# Altium schematic sheet Fighter_old.SchDoc
size 292 x 193 mm; Author: Power Lin; SheetNumber: 1; SheetTotal: 1; Website: wiki-power.com
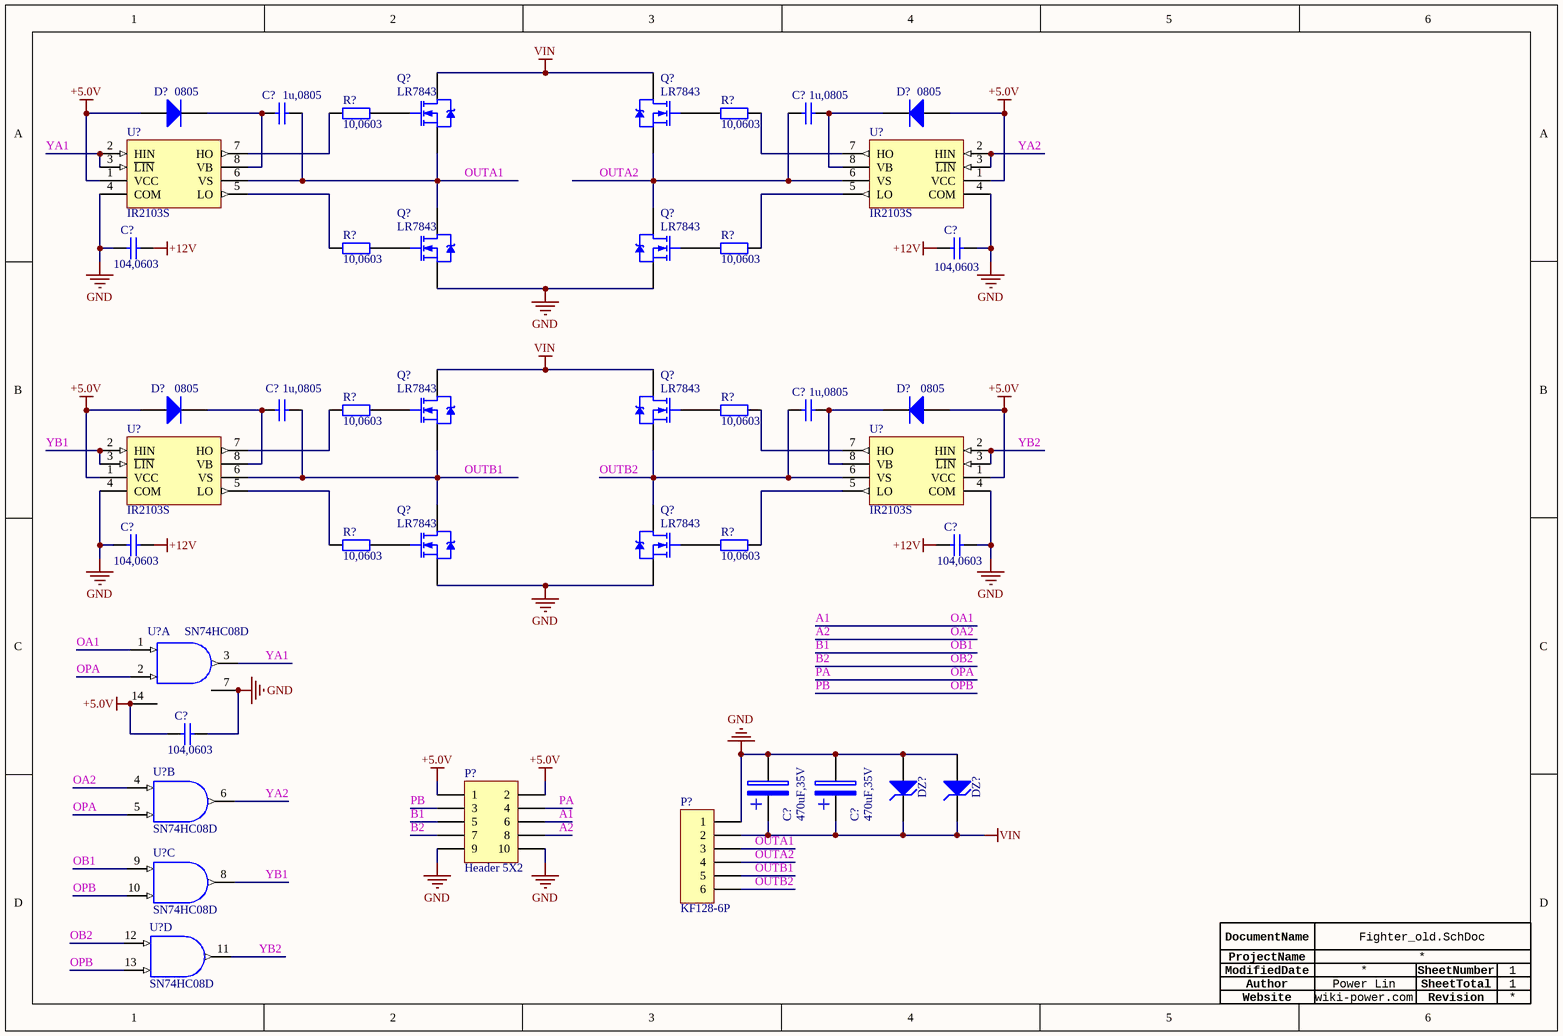
[diagram p0: Fighter_old.SchDoc]

## Parts
(Parts that share a designator on the sheet are numbered #1, #2 ... from top to bottom, then left to right.)
C?#1  1u,0805  [C0805]
C?#2  1u,0805  [C0805]
C?#3  104,0603  [C0603]
C?#4  104,0603  [C0603]
C?#5  1u,0805  [C0805]
C?#6  1u,0805  [C0805]
C?#7  104,0603  [C0603]
C?#8  104,0603  [C0603]
C?#9  104,0603  [C0603]
C?#10  470uF,35V  [贴片固态电容10*10.2]
C?#11  470uF,35V  [贴片固态电容10*10.2]
D?#1  0805  [D0805]
D?#2  0805  [D0805]
D?#3  0805  [D0805]
D?#4  0805  [D0805]
DZ?#1  (no value)  [D2512]
DZ?#2  (no value)  [D2512]
P?#1  Header 5X2  [HDR2X5]
P?#2  KF128-6P  [KF128-6P]
Q?#1  LR7843  [TO-252AA_M]
Q?#2  LR7843  [TO-252AA_M]
Q?#3  LR7843  [TO-252AA_M]
Q?#4  LR7843  [TO-252AA_M]
Q?#5  LR7843  [TO-252AA_M]
Q?#6  LR7843  [TO-252AA_M]
Q?#7  LR7843  [TO-252AA_M]
Q?#8  LR7843  [TO-252AA_M]
R?#1  10,0603  [R0603]
R?#2  10,0603  [R0603]
R?#3  10,0603  [R0603]
R?#4  10,0603  [R0603]
R?#5  10,0603  [R0603]
R?#6  10,0603  [R0603]
R?#7  10,0603  [R0603]
R?#8  10,0603  [R0603]
U?#1  IR2103S  [SO-8_M]
U?#2  IR2103S  [SO-8_M]
U?#3  IR2103S  [SO-8_M]
U?#4  IR2103S  [SO-8_M]
U?#5  SN74HC08D  [D014_N]  (part A of 4)
U?#6  SN74HC08D  [D014_N]  (part B of 4)
U?#7  SN74HC08D  [D014_N]  (part C of 4)
U?#8  SN74HC08D  [D014_N]  (part D of 4)

## Nets
+5.0V: C?#9.2 D?#1.1(A) D?#2.1(A) D?#3.1(A) D?#4.1(A) P?#1.1 P?#1.2 U?#1.1(VCC) U?#2.1(VCC) U?#3.1(VCC) U?#4.1(VCC) U?#5.14(+5V)
+12V: C?#3.1 C?#4.2 C?#7.1 C?#8.2
GND: C?#3.2 C?#4.1 C?#7.2 C?#8.1 C?#9.1 C?#10.2 C?#11.2 DZ?#1.1(A) DZ?#2.1(A) P?#1.9 P?#1.10 P?#2.1 Q?#3.3(S) Q?#4.3(S) Q?#7.3(S) Q?#8.3(S) U?#1.4(COM) U?#2.4(COM) U?#3.4(COM) U?#4.4(COM) U?#5.7(GND) U?#6.7(GND) U?#7.7(GND) U?#8.7(GND)
VCC: U?#6.14(VCC) U?#7.14(VCC) U?#8.14(VCC)
VIN: C?#10.1 C?#11.1 DZ?#1.2(K) DZ?#2.2(K) P?#2.2 Q?#1.4(D) Q?#2.4(D) Q?#5.4(D) Q?#6.4(D)
A1: P?#1.6 U?#5.1(A)  [also labelled OA1]
A2: P?#1.8 U?#6.4(A)  [also labelled OA2]
B1: P?#1.5 U?#7.9(A)  [also labelled OB1]
B2: P?#1.7 U?#8.12(A)  [also labelled OB2]
OPA: P?#1.4 U?#5.2(B) U?#6.5(B)  [also labelled PA]
OPB: P?#1.3 U?#7.10(B) U?#8.13(B)  [also labelled PB]
OUTA1: C?#1.2 P?#2.3 Q?#1.3(S) Q?#3.4(D) U?#1.6(VS)
OUTA2: C?#2.1 P?#2.4 Q?#2.3(S) Q?#4.4(D) U?#2.6(VS)
OUTB1: C?#5.2 P?#2.5 Q?#5.3(S) Q?#7.4(D) U?#3.6(VS)
OUTB2: C?#6.1 P?#2.6 Q?#6.3(S) Q?#8.4(D) U?#4.6(VS)
YA1: U?#1.2(HIN) U?#1.3(~{LIN}) U?#5.3(Y)
YA2: U?#2.2(HIN) U?#2.3(~{LIN}) U?#6.6(Y)
YB1: U?#3.2(HIN) U?#3.3(~{LIN}) U?#7.8(Y)
YB2: U?#4.2(HIN) U?#4.3(~{LIN}) U?#8.11(Y)
NetC?#1_1: C?#1.1 D?#1.2(K) U?#1.8(VB)
NetC?#2_2: C?#2.2 D?#2.2(K) U?#2.8(VB)
NetC?#5_1: C?#5.1 D?#3.2(K) U?#3.8(VB)
NetC?#6_2: C?#6.2 D?#4.2(K) U?#4.8(VB)
NetQ?#1_1: Q?#1.1(G) R?#1.2
NetQ?#2_1: Q?#2.1(G) R?#2.1
NetQ?#3_1: Q?#3.1(G) R?#3.2
NetQ?#4_1: Q?#4.1(G) R?#4.1
NetQ?#5_1: Q?#5.1(G) R?#5.2
NetQ?#6_1: Q?#6.1(G) R?#6.1
NetQ?#7_1: Q?#7.1(G) R?#7.2
NetQ?#8_1: Q?#8.1(G) R?#8.1
NetR?#1_1: R?#1.1 U?#1.7(HO)
NetR?#2_2: R?#2.2 U?#2.7(HO)
NetR?#3_1: R?#3.1 U?#1.5(LO)
NetR?#4_2: R?#4.2 U?#2.5(LO)
NetR?#5_1: R?#5.1 U?#3.7(HO)
NetR?#6_2: R?#6.2 U?#4.7(HO)
NetR?#7_1: R?#7.1 U?#3.5(LO)
NetR?#8_2: R?#8.2 U?#4.5(LO)

## Notes on the sheet
- Author
- DocumentName
- ModifiedDate
- ProjectName
- SheetNumber
- SheetTotal
- Website
- Revision
- (in symbol CAP1) +

## Library data of the parts
C?#1 C?#2 C?#5 C?#6 = Cap
C?#3 C?#4 C?#7-C?#9 = CAP: Capacitor; Value: 100nF; Published: 8-Jun-2000; Revision: July-2002: Re-released for DXP Platform.; Publisher: Altium Limited
C?#10 C?#11 = CAP1: 电解电容
D?#1-D?#4 = Diode: Default Diode
DZ?#1 DZ?#2 = D Zener
P?#1 = Header 5X2: Header, 5-Pin, Dual row; LatestRevisionDate: 17-Jul-2002; LatestRevisionNote: Re-released for DXP Platform.; Publisher: Altium Limited
P?#2 = Header6
Q?#1-Q?#8 = IRFR1205: HEXFET Power MOSFET; Note: Pin 2 is trimmed and is electrically connected to Drain.; Published: 8-Jun-2000; LatestRevisionDate: 20-Nov-2009; LatestRevisionNote: IPC-7351 Footprint Added.; DatasheetVersion: PD-91318B; PackageVersion: Feb-2003; PackageReference: TO-252AA; Publisher: Altium Limited; PackageDescription: 3-Pin HEXFET Package 2.28 mm Pitch, 9.9 mm Lead Span; Code_JEDEC: TO-252-AA; ComponentLink1Description: Manufacturer Link; ComponentLink1URL: http://www.irf.com/; ComponentLink2Description: Datasheet; ComponentLink2URL: http://www.irf.com/product-info/datasheets/data/irfr1205.pdf
R?#1-R?#8 = Res2: Resistor; Published: 8-Jun-2000; LatestRevisionDate: 17-Jul-2002; LatestRevisionNote: Re-released for DXP Platform.; Publisher: Altium Limited
U?#1-U?#4 = IR2103S: High and Low Side Driver; Published: 8-Jun-2000; LatestRevisionDate: 13-Apr-2006; LatestRevisionNote: IPC-7351 Footprint Added.; DatasheetVersion: PD600451; PackageVersion: Feb-2001; PackageReference: SO-8; Publisher: Altium Limited; PackageDescription: 8-Pin Plastic Small Outline Integrated Circuit 1.27 mm Pitch; Code_JEDEC: MS-012-AA; Code_IPC: SOIC127P600-8; ComponentLink1Description: Manufacturer Link; ComponentLink1URL: http://www.irf.com/; ComponentLink2Description: Datasheet; ComponentLink2URL: http://www.irf.com/product-info/datasheets/data/ir2103.pdf
U?#5-U?#8 = SN74HC08D: Quadruple 2-Input Positive-AND Gate; Published: 8-Jun-2000; LatestRevisionDate: 13-Apr-2006; LatestRevisionNote: IPC-7351 Footprint Added.; DatasheetVersion: May-1997; PackageVersion: Jan-1998; PackageReference: D014; Publisher: Altium Limited; PackageDescription: 14-Pin Small Outline Integrated Circuit 1.27 mm Pitch; Code_IPC: SOIC127P600-14; ComponentLink1Description: Manufacturer Link; ComponentLink1URL: http://www.ti.com/; ComponentLink2Description: Datasheet; ComponentLink2URL: http://www-s.ti.com/sc/ds/SN74HC08.pdf